# Altium schematic sheet Top_Sheet.SchDoc
size A4; CompanyName: Universidad de Santiago de Chile; Address1: Av. Ecuador Nº 3519, Estación Central; Address2: Santiago; Address3: Chile; CompanyName2: E2Tech
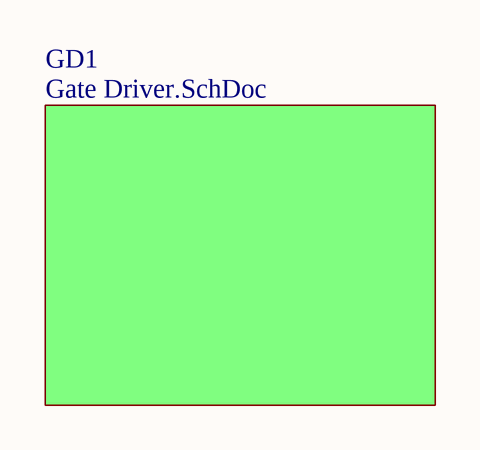
[diagram p0: Top_Sheet.SchDoc]

## Sub-sheets
GD1 = Gate Driver.SchDoc: no entries

## Notes on the sheet
- Title
- Size:
- Date:
- A4
- Revision:
- Time:
- Sheet
- of
- Author:
- Project: